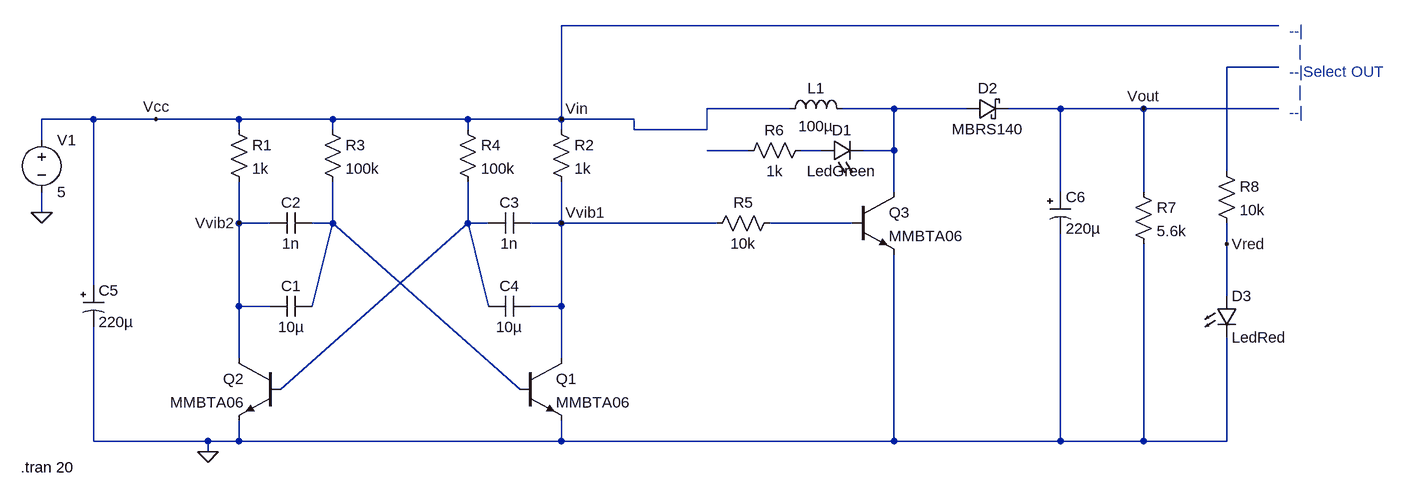
[diagram p0: schematic 10_AST_MULTIVIB_W_DC_DC_CONV.asc]
10_AST_MULTIVIB_W_DC_DC_CONV.asc, the LTspice schematic file:
Version 4
SHEET 1 1708 680
WIRE 1520 -368 416 -368
WIRE 1520 -304 1440 -304
WIRE 768 -240 640 -240
WIRE 928 -240 848 -240
WIRE 1040 -240 928 -240
WIRE 1184 -240 1104 -240
WIRE 1312 -240 1184 -240
WIRE 1520 -240 1312 -240
WIRE -304 -224 -384 -224
WIRE -208 -224 -304 -224
WIRE -80 -224 -208 -224
WIRE 64 -224 -80 -224
WIRE 272 -224 64 -224
WIRE 416 -224 416 -368
WIRE 416 -224 272 -224
WIRE 528 -224 416 -224
WIRE -80 -208 -80 -224
WIRE 64 -208 64 -224
WIRE 272 -208 272 -224
WIRE 416 -208 416 -224
WIRE 528 -208 528 -224
WIRE 640 -208 640 -240
WIRE 640 -208 528 -208
WIRE -384 -192 -384 -224
WIRE 704 -176 640 -176
WIRE 816 -176 784 -176
WIRE 928 -176 928 -240
WIRE 928 -176 880 -176
WIRE 1440 -144 1440 -304
WIRE 928 -112 928 -176
WIRE 1184 -112 1184 -240
WIRE 1312 -112 1312 -240
WIRE -384 -80 -384 -112
WIRE -80 -64 -80 -128
WIRE -32 -64 -80 -64
WIRE 64 -64 64 -128
WIRE 64 -64 32 -64
WIRE 272 -64 272 -128
WIRE 304 -64 272 -64
WIRE 416 -64 416 -128
WIRE 416 -64 368 -64
WIRE 656 -64 416 -64
WIRE 864 -64 736 -64
WIRE 1440 -32 1440 -64
WIRE -304 32 -304 -224
WIRE 1440 48 1440 -32
WIRE -80 64 -80 -64
WIRE -32 64 -80 64
WIRE 32 64 64 -64
WIRE 304 64 272 -64
WIRE 416 64 416 -64
WIRE 416 64 368 64
WIRE -80 144 -80 64
WIRE 416 144 416 64
WIRE -16 192 272 -64
WIRE 352 192 64 -64
WIRE -304 272 -304 96
WIRE -128 272 -304 272
WIRE -80 272 -80 240
WIRE -80 272 -128 272
WIRE 416 272 416 240
WIRE 416 272 -80 272
WIRE 928 272 928 -16
WIRE 928 272 416 272
WIRE 1184 272 1184 -48
WIRE 1184 272 928 272
WIRE 1312 272 1312 -32
WIRE 1312 272 1184 272
WIRE 1440 272 1440 112
WIRE 1440 272 1312 272
WIRE -128 288 -128 272
FLAG -128 288 0
FLAG 416 -224 Vin
FLAG 1312 -240 Vout
FLAG -208 -224 Vcc
FLAG -384 -80 0
FLAG 1440 -32 Vred
FLAG 416 -64 Vvib1
FLAG -80 -64 Vvib2
SYMBOL npn 352 144 R0
SYMATTR InstName Q1
SYMATTR Value MMBTA06
SYMBOL npn -16 144 M0
SYMATTR InstName Q2
SYMATTR Value MMBTA06
SYMBOL cap 32 48 R90
WINDOW 0 0 32 VBottom 2
WINDOW 3 32 32 VTop 2
SYMATTR InstName C1
SYMATTR Value 10µ
SYMATTR SpiceLine V=25 Irms=0 Rser=0.001 Lser=0 mfg="TDK" pn="C575OX7RIE106M" type="X7R"
SYMBOL cap 32 -80 R90
WINDOW 0 0 32 VBottom 2
WINDOW 3 32 32 VTop 2
SYMATTR InstName C2
SYMATTR Value 1n
SYMBOL cap 368 -80 R90
WINDOW 0 0 32 VBottom 2
WINDOW 3 32 32 VTop 2
SYMATTR InstName C3
SYMATTR Value 1n
SYMBOL cap 368 48 R90
WINDOW 0 0 32 VBottom 2
WINDOW 3 32 32 VTop 2
SYMATTR InstName C4
SYMATTR Value 10µ
SYMATTR SpiceLine V=25 Irms=0 Rser=0.001 Lser=0 mfg="TDK" pn="C575OX7RIE106M" type="X7R"
SYMBOL polcap -320 32 R0
WINDOW 3 24 56 Left 2
SYMATTR Value 220µ
SYMATTR InstName C5
SYMATTR Description Capacitor
SYMATTR Type cap
SYMATTR SpiceLine V=25 Irms=575m Rser=0.12 Lser=0 mfg="Panasonic" pn="ECA1EFQ221L" type="Al electrolytic"
SYMBOL res -96 -224 R0
SYMATTR InstName R1
SYMATTR Value 1k
SYMATTR SpiceLine tol=1
SYMBOL res 400 -224 R0
SYMATTR InstName R2
SYMATTR Value 1k
SYMATTR SpiceLine tol=1
SYMBOL res 48 -224 R0
SYMATTR InstName R3
SYMATTR Value 100k
SYMATTR SpiceLine tol=1
SYMBOL res 256 -224 R0
SYMATTR InstName R4
SYMATTR Value 100k
SYMATTR SpiceLine tol=1
SYMBOL res 752 -80 R90
WINDOW 0 0 56 VBottom 2
WINDOW 3 32 56 VTop 2
SYMATTR InstName R5
SYMATTR Value 10k
SYMATTR SpiceLine tol=1
SYMBOL npn 864 -112 R0
SYMATTR InstName Q3
SYMATTR Value MMBTA06
SYMBOL res 800 -192 R90
WINDOW 0 0 56 VBottom 2
WINDOW 3 32 56 VTop 2
SYMATTR InstName R6
SYMATTR Value 1k
SYMATTR SpiceLine tol=1
SYMBOL LED 816 -160 R270
WINDOW 0 32 32 VTop 2
WINDOW 3 0 32 VBottom 2
SYMATTR InstName D1
SYMATTR Value LedGreen
SYMATTR Description Diode
SYMATTR Type diode
SYMBOL schottky 1040 -224 R270
WINDOW 0 32 32 VTop 2
WINDOW 3 0 32 VBottom 2
SYMATTR InstName D2
SYMATTR Value MBRS140
SYMATTR Description Diode
SYMATTR Type diode
SYMBOL ind 752 -224 R270
WINDOW 0 32 56 VTop 2
WINDOW 3 5 56 VBottom 2
SYMATTR InstName L1
SYMATTR Value 100µ
SYMATTR SpiceLine Ipk=0.52 Rser=0.77 Rpar=36357 Cpar=6p mfg="Wurth Elektronik" pn="74408943101 WE-SPC 4838"
SYMBOL res 1296 -128 R0
SYMATTR InstName R7
SYMATTR Value 5.6k
SYMATTR SpiceLine tol=1
SYMBOL polcap 1168 -112 R0
WINDOW 3 24 56 Left 2
SYMATTR Value 220µ
SYMATTR InstName C6
SYMATTR Description Capacitor
SYMATTR Type cap
SYMATTR SpiceLine V=25 Irms=575m Rser=0.12 Lser=0 mfg="Panasonic" pn="ECA1EFQ221L" type="Al electrolytic"
SYMBOL res 1424 -160 R0
SYMATTR InstName R8
SYMATTR Value 10k
SYMATTR SpiceLine tol=1
SYMBOL LED 1424 48 R0
SYMATTR InstName D3
SYMATTR Value LedRed
SYMATTR Description Diode
SYMATTR Type diode
SYMBOL voltage -384 -208 R0
WINDOW 123 0 0 Left 2
WINDOW 39 0 0 Left 2
SYMATTR InstName V1
SYMATTR Value 5
TEXT 1536 -360 Left 2 ;--|\n  |\n--|Select OUT\n  |\n--|
TEXT -416 312 Left 2 !.tran 20

The netlist it stands for:
* 10_AST_MULTIVIB_W_DC_DC_CONV.asc
Q1 Vvib1 N005 0 0 MMBTA06
Q2 Vvib2 N006 0 0 MMBTA06
C1 N005 Vvib2 10µ V=25 Irms=0 Rser=0.001 Lser=0 mfg="TDK" pn="C575OX7RIE106M" type="X7R"
C2 N005 Vvib2 1n
C3 Vvib1 N006 1n
C4 Vvib1 N006 10µ V=25 Irms=0 Rser=0.001 Lser=0 mfg="TDK" pn="C575OX7RIE106M" type="X7R"
C5 Vcc 0 220µ V=25 Irms=575m Rser=0.12 Lser=0 mfg="Panasonic" pn="ECA1EFQ221L" type="Al electrolytic"
R1 Vcc Vvib2 1k tol=1
R2 Vcc Vvib1 1k tol=1
R3 Vcc N005 100k tol=1
R4 Vcc N006 100k tol=1
R5 N007 Vvib1 10k tol=1
Q3 N002 N007 0 0 MMBTA06
R6 N004 N003 1k tol=1
D1 N004 N002 LedGreen
D2 N002 Vout MBRS140
L1 Vcc N002 100µ Ipk=0.52 Rser=0.77 Rpar=36357 Cpar=6p mfg="Wurth Elektronik" pn="74408943101 WE-SPC 4838"
R7 Vout 0 5.6k tol=1
C6 Vout 0 220µ V=25 Irms=575m Rser=0.12 Lser=0 mfg="Panasonic" pn="ECA1EFQ221L" type="Al electrolytic"
R8 N001 Vred 10k tol=1
D3 Vred 0 LedRed
V1 Vcc 0 5
.model D D
.lib standard.dio
.model NPN NPN
.model PNP PNP
.lib standard.bjt
* --|
*   |
* --|Select OUT
*   |
* --|
.tran 20
.backanno
.end